# Altium schematic sheet lpf.SchDoc
size A4; SheetNumber: 3; SheetTotal: 4
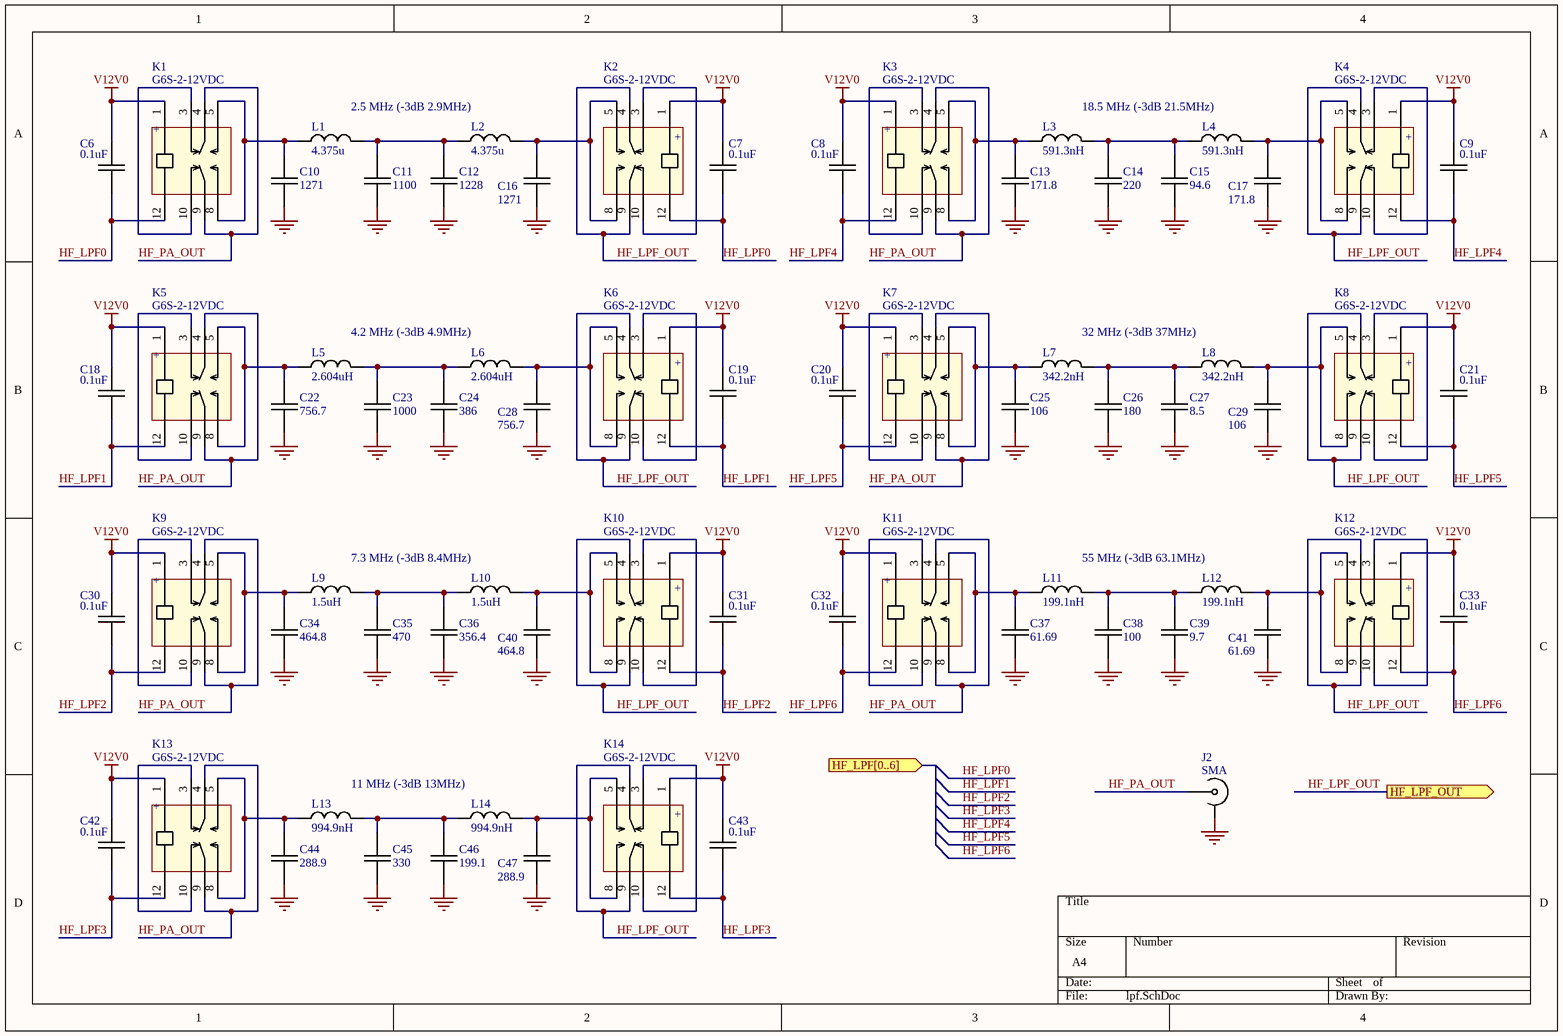
[diagram p0: lpf.SchDoc]

## Parts
C6  0.1uF  [CAPC2013X100N]
C7  0.1uF  [CAPC2013X100N]
C8  0.1uF  [CAPC2013X100N]
C9  0.1uF  [CAPC2013X100N]
C10  1271  [CAPC3216X125N]
C11  1100  [CAPC3216X125N]
C12  1228  [CAPC3216X125N]
C13  171.8  [CAPC3216X125N]
C14  220  [CAPC3216X125N]
C15  94.6  [CAPC3216X125N]
C16  1271  [CAPC3216X125N]
C17  171.8  [CAPC3216X125N]
C18  0.1uF  [CAPC2013X100N]
C19  0.1uF  [CAPC2013X100N]
C20  0.1uF  [CAPC2013X100N]
C21  0.1uF  [CAPC2013X100N]
C22  756.7  [CAPC3216X125N]
C23  1000  [CAPC3216X125N]
C24  386  [CAPC3216X125N]
C25  106  [CAPC3216X125N]
C26  180  [CAPC3216X125N]
C27  8.5  [CAPC3216X125N]
C28  756.7  [CAPC3216X125N]
C29  106  [CAPC3216X125N]
C30  0.1uF  [CAPC2013X100N]
C31  0.1uF  [CAPC2013X100N]
C32  0.1uF  [CAPC2013X100N]
C33  0.1uF  [CAPC2013X100N]
C34  464.8  [CAPC3216X125N]
C35  470  [CAPC3216X125N]
C36  356.4  [CAPC3216X125N]
C37  61.69  [CAPC3216X125N]
C38  100  [CAPC3216X125N]
C39  9.7  [CAPC3216X125N]
C40  464.8  [CAPC3216X125N]
C41  61.69  [CAPC3216X125N]
C42  0.1uF  [CAPC2013X100N]
C43  0.1uF  [CAPC2013X100N]
C44  288.9  [CAPC3216X125N]
C45  330  [CAPC3216X125N]
C46  199.1  [CAPC3216X125N]
C47  288.9  [CAPC3216X125N]
J2  SMA  [SMA002]
K1  G6S-2-12VDC  [G6S-2]
K2  G6S-2-12VDC  [G6S-2]
K3  G6S-2-12VDC  [G6S-2]
K4  G6S-2-12VDC  [G6S-2]
K5  G6S-2-12VDC  [G6S-2]
K6  G6S-2-12VDC  [G6S-2]
K7  G6S-2-12VDC  [G6S-2]
K8  G6S-2-12VDC  [G6S-2]
K9  G6S-2-12VDC  [G6S-2]
K10  G6S-2-12VDC  [G6S-2]
K11  G6S-2-12VDC  [G6S-2]
K12  G6S-2-12VDC  [G6S-2]
K13  G6S-2-12VDC  [G6S-2]
K14  G6S-2-12VDC  [G6S-2]
L1  4.375u  [T50-2]
L2  4.375u  [T50-2]
L3  591.3nH  [T50-6]
L4  591.3nH  [T50-6]
L5  2.604uH  [T50-2]
L6  2.604uH  [T50-2]
L7  342.2nH  [T50-6]
L8  342.2nH  [T50-6]
L9  1.5uH  [T50-6]
L10  1.5uH  [T50-6]
L11  199.1nH  [T50-6]
L12  199.1nH  [T50-6]
L13  994.9nH  [T50-6]
L14  994.9nH  [T50-6]

## Ports
HF_LPF[0..6] (in), HF_LPF_OUT (out)

## Nets
GND: C10.1 C11.1 C12.1 C13.1 C14.1 C15.1 C16.1 C17.1 C22.1 C23.1 C24.1 C25.1 C26.1 C27.1 C28.1 C29.1 C34.1 C35.1 C36.1 C37.1 C38.1 C39.1 C40.1 C41.1 C44.1 C45.1 C46.1 C47.1 J2.2(GND)
V12V0: C6.2 C7.2 C8.2 C9.2 C18.2 C19.2 C20.2 C21.2 C30.2 C31.2 C32.2 C33.2 C42.2 C43.2 K1.1 K2.1 K3.1 K4.1 K5.1 K6.1 K7.1 K8.1 K9.1 K10.1 K11.1 K12.1 K13.1 K14.1
HF_LPF0: C6.1 C7.1 K1.12 K2.12
HF_LPF1: C18.1 C19.1 K5.12 K6.12
HF_LPF2: C30.1 C31.1 K9.12 K10.12
HF_LPF3: C42.1 C43.1 K13.12 K14.12
HF_LPF4: C8.1 C9.1 K3.12 K4.12
HF_LPF5: C20.1 C21.1 K7.12 K8.12
HF_LPF6: C32.1 C33.1 K11.12 K12.12
HF_LPF_OUT: K2.4 K2.9 K4.4 K4.9 K6.4 K6.9 K8.4 K8.9 K10.4 K10.9 K12.4 K12.9 K14.4 K14.9 ; port HF_LPF_OUT
HF_PA_OUT: J2.1(RF) K1.4 K1.9 K3.4 K3.9 K5.4 K5.9 K7.4 K7.9 K9.4 K9.9 K11.4 K11.9 K13.4 K13.9
NetC10_2: C10.2 K1.5 K1.8 L1.1
NetC11_2: C11.2 C12.2 L1.2 L2.1
NetC13_2: C13.2 K3.5 K3.8 L3.1
NetC14_2: C14.2 C15.2 L3.2 L4.1
NetC16_2: C16.2 K2.5 K2.8 L2.2
NetC17_2: C17.2 K4.5 K4.8 L4.2
NetC22_2: C22.2 K5.5 K5.8 L5.1
NetC23_2: C23.2 C24.2 L5.2 L6.1
NetC25_2: C25.2 K7.5 K7.8 L7.1
NetC26_2: C26.2 C27.2 L7.2 L8.1
NetC28_2: C28.2 K6.5 K6.8 L6.2
NetC29_2: C29.2 K8.5 K8.8 L8.2
NetC34_2: C34.2 K9.5 K9.8 L9.1
NetC35_2: C35.2 C36.2 L9.2 L10.1
NetC37_2: C37.2 K11.5 K11.8 L11.1
NetC38_2: C38.2 C39.2 L11.2 L12.1
NetC40_2: C40.2 K10.5 K10.8 L10.2
NetC41_2: C41.2 K12.5 K12.8 L12.2
NetC44_2: C44.2 K13.5 K13.8 L13.1
NetC45_2: C45.2 C46.2 L13.2 L14.1
NetC47_2: C47.2 K14.5 K14.8 L14.2
NetK1_3: K1.3 K1.10
NetK2_3: K2.3 K2.10
NetK3_3: K3.3 K3.10
NetK4_3: K4.3 K4.10
NetK5_3: K5.3 K5.10
NetK6_3: K6.3 K6.10
NetK7_3: K7.3 K7.10
NetK8_3: K8.3 K8.10
NetK9_3: K9.3 K9.10
NetK10_3: K10.3 K10.10
NetK11_3: K11.3 K11.10
NetK12_3: K12.3 K12.10
NetK13_3: K13.3 K13.10
NetK14_3: K14.3 K14.10

## Notes on the sheet
- 2.5 MHz (-3dB 2.9MHz)
- 18.5 MHz (-3dB 21.5MHz)
- 4.2 MHz (-3dB 4.9MHz)
- 32 MHz (-3dB 37MHz)
- 7.3 MHz (-3dB 8.4MHz)
- 55 MHz (-3dB 63.1MHz)
- 11 MHz (-3dB 13MHz)
- (in symbol G6S-2-12VDC) +

## Library data of the parts
C6-C9 C18-C21 C30-C33 C42 C43 = Cap0805: Capacitor 2x1.25 mm
C10-C17 C22-C29 C34-C41 C44-C47 = Cap1206: Capacitor 3.2x1.6 mm
J2 = RF Connector
K1-K14 = G6S-2-12VDC: Compact, Industry-Standard 2-pole relay
L1 L2 L5 L6 = Inductor: T50-2
L3 L4 L7-L14 = Inductor: T50-6